# Altium project CW308T_ATSAML11.PrjPcb
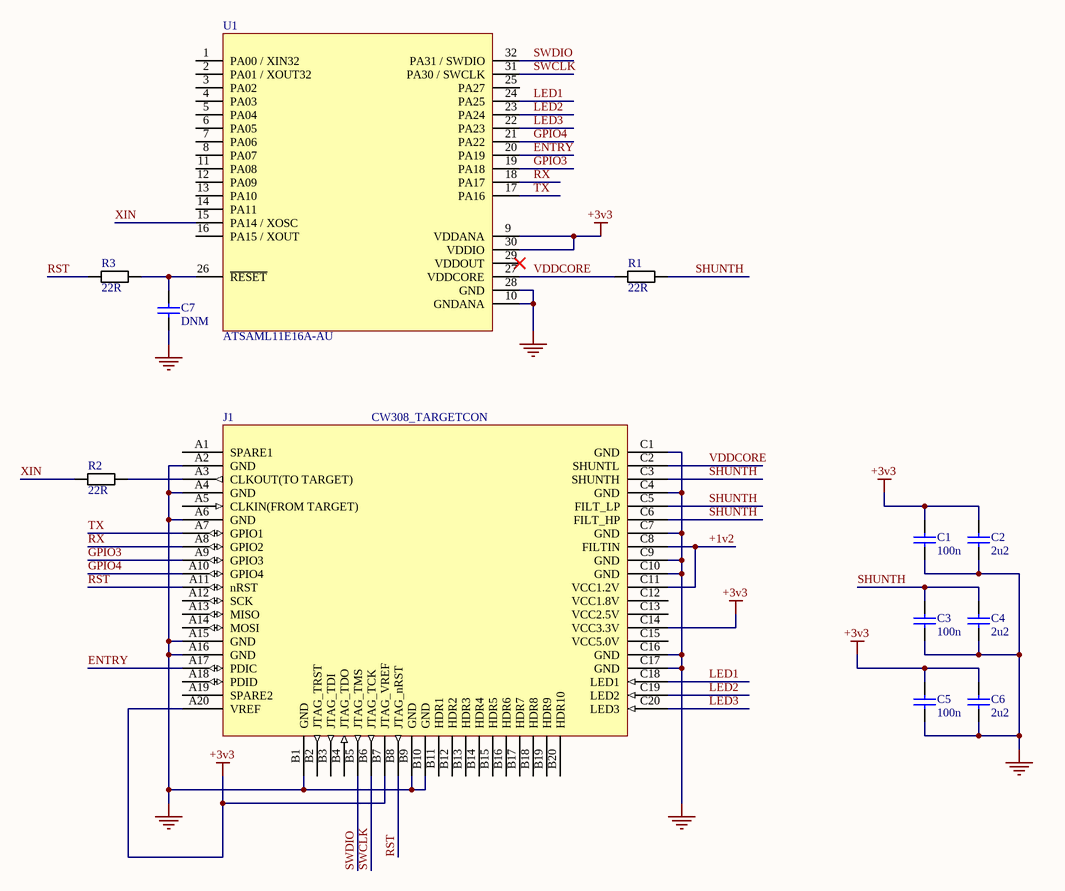
[diagram p0: CW308T_ATSAML11.SchDoc]
PrjLicense: GPL; PrjName: SAML11 Target; PrjRev: 02
1 sheet, 12 parts. Net scope: global (net labels, ports and power ports of the same name join across sheets).
Board files: CW308T_ATSAML11.PcbDoc, CW308T_SAML11_PANEL.PcbDoc

## Sheet CW308T_ATSAML11.SchDoc: CW308T-SAML11 Microcontroller
size Letter; Organization: NewAE Technology Inc.; Address1: 1083 Queen St., Suite 196; Address2: Halifax; Address3: NS; Address4: Canada B3H 0B2; SheetApproved: YES

### Parts
C1  100n  [CAPC0603_M]
C2  2u2  [CAPC0603_M]
C3  100n  [CAPC0603_M]
C4  2u2  [CAPC0603_M]
C5  100n  [CAPC0603_M]
C6  2u2  [CAPC0603_M]
C7  DNM  [CAPC0603_M]
J1  CW308_TARGETCON  [CW308_TBOARD_CONN]
R1  22R  [RESC1608X55N]
R2  22R  [RESC1608X55N]
R3  22R  [RESC1608X55N]
U1  ATSAML11E16A-AU

### Nets
+3v3: C1.1 C2.1 C5.1 C6.1 J1.A20(VREF) J1.B7(JTAG_VREF) J1.C14(VCC3.3V) U1.9(VDDANA) U1.30(VDDIO)
GND: C1.2 C2.2 C3.2 C4.2 C5.2 C6.2 C7.2 J1.A2(GND) J1.A4(GND) J1.A6(GND) J1.A15(GND) J1.A16(GND) J1.B1(GND) J1.B9(GND) J1.B10(GND) J1.C1(GND) J1.C4(GND) J1.C7(GND) J1.C9(GND) J1.C10(GND) J1.C16(GND) J1.C17(GND) U1.10(GNDANA) U1.28(GND)
+1v2: J1.C8(FILTIN) J1.C11(VCC1.2V)
ENTRY: J1.A17(PDIC) U1.20(PA19)
GPIO3: J1.A9(GPIO3) U1.19(PA18)
GPIO4: J1.A10(GPIO4) U1.21(PA22)
LED1: J1.C18(LED1) U1.24(PA25)
LED2: J1.C19(LED2) U1.23(PA24)
LED3: J1.C20(LED3) U1.22(PA23)
RST: J1.A11(nRST) J1.B8(JTAG_nRST) R3.1
RX: J1.A8(GPIO2) U1.18(PA17)
SHUNTH: C3.1 C4.1 J1.C3(SHUNTH) J1.C5(FILT_LP) J1.C6(FILT_HP) R1.2
SWCLK: J1.B6(JTAG_TCK) U1.31(PA30_/_SWCLK)
SWDIO: J1.B5(JTAG_TMS) U1.32(PA31_/_SWDIO)
TX: J1.A7(GPIO1) U1.17(PA16)
VDDCORE: J1.C2(SHUNTL) R1.1 U1.27(VDDCORE)
XIN: R2.1 U1.15(PA14_/_XOSC)
NetC7_1: C7.1 R3.2 U1.26(~{RESET})
NetJ1_A3: J1.A3(CLKOUT(TO_TARGET)) R2.2

Not connected (* = marked no-connect by the designer): J1 A1(SPARE1) A5(CLKIN(FROM_TARGET)) A12(SCK) A13(MISO) A14(MOSI) A18(PDID) A19(SPARE2) B2(JTAG_TRST) B3(JTAG_TDI) B4(JTAG_TDO) B11(HDR1) B12(HDR2) B13(HDR3) B14(HDR4) B15(HDR5) B16(HDR6) B17(HDR7) B18(HDR8) B19(HDR9) B20(HDR10) C12(VCC1.8V) C13(VCC2.5V) C15(VCC5.0V); U1 1(PA00_/_XIN32) 2(PA01_/_XOUT32) 3(PA02) 4(PA03) 5(PA04) 6(PA05) 7(PA06) 8(PA07) 11(PA08) 12(PA09) 13(PA10) 14(PA11) 16(PA15_/_XOUT) 25(PA27) 29(VDDOUT)*

### Notes on the sheet
- Title:
- Date:
- Rev:
- Time:
- Project:
- Sheet
- of
- License:
- Copyright © NewAE Technology Inc.
- Approved:
- NewAE.com
- File:

### Library data of the parts
C1 C3 C5 = CCHIP-100n-0603: 100n, 0603; Manufacture 1: Kemet; Manufacture Part Number 1: C0603C104K5RACTU; Component Group: Capacitor; Case-EIA: 0603; Case-Metric: 1608; Rated Voltage: 50VDC; Part Number: CCHIP-100n-0603; Footprint: 0603; Pin Count: 2; Supplier 1: Digi-Key; Supplier Part Number 1: 399-5089-2-ND; Value: 100n; Mounting Technology: SMT; Component Kind: Standard; Component Type: Standard
C2 C4 C6 = CCHIP-2u2-0603: 2u2, 0603; Manufacture 1: Samsung; Manufacture Part Number 1: CL10B225KP8NNNC; Component Group: Capacitor; Case-EIA: 0603; Case-Metric: 1608; Rated Voltage: 10VDC; Part Number: CCHIP-2u2-0603; Footprint: 0603; Pin Count: 2; Supplier 1: Digi-Key; Supplier Part Number 1: 1276-1134-2-ND; Value: 2u2; Mounting Technology: SMT; Component Kind: Standard; Component Type: Standard
C7 = CCHIP-100n-0603: Manufacture 1: Kemet; Manufacture Part Number 1: C0603C104K5RACTU; Component Group: Capacitor; Value: 100n; Case-EIA: 0603; Case-Metric: 1608; Rated Voltage: 50VDC; Part Number: CCHIP-100n-0603; Footprint: 0603; Pin Count: 2; Supplier 1: Digi-Key; Supplier Part Number 1: 399-5089-2-ND; Mounting Technology: SMT; Component Kind: Standard; Component Type: Standard
J1 = CW308_TBOARD: CW308 "Standard" Target Board Connector; Component Group: Mechanical; Pitch: 2.54mm; Part Number: CW308_TBOARD; Pin Count: 60; Mounting Technology: Through-hole; Component Kind: Standard; Component Type: Standard
R1-R3 = RCHIP-22R-0603: 22R res, 0603, 1%, 1/10W; Manufacture 1: Yageo; Manufacture Part Number 1: RC0603FR-0722RL; Component Group: Resistor; Case-EIA: 0603; Case-Metric: 1608; Rated Power: 0.1W; Rated Voltage: 75VDC; Part Number: RCHIP-22R-0603; Footprint: 0603; Pin Count: 2; Supplier 1: Digi-Key; Supplier Part Number 1: 311-22.0HRCT-ND; Value: 22R; Tolerance: 1%; Mounting Technology: SMT; Temperature Range: -55C to 155C; Component Kind: Standard; Component Type: Standard